# EasyEDA Pro project modern-cadet-v2.eprj, board PCB7
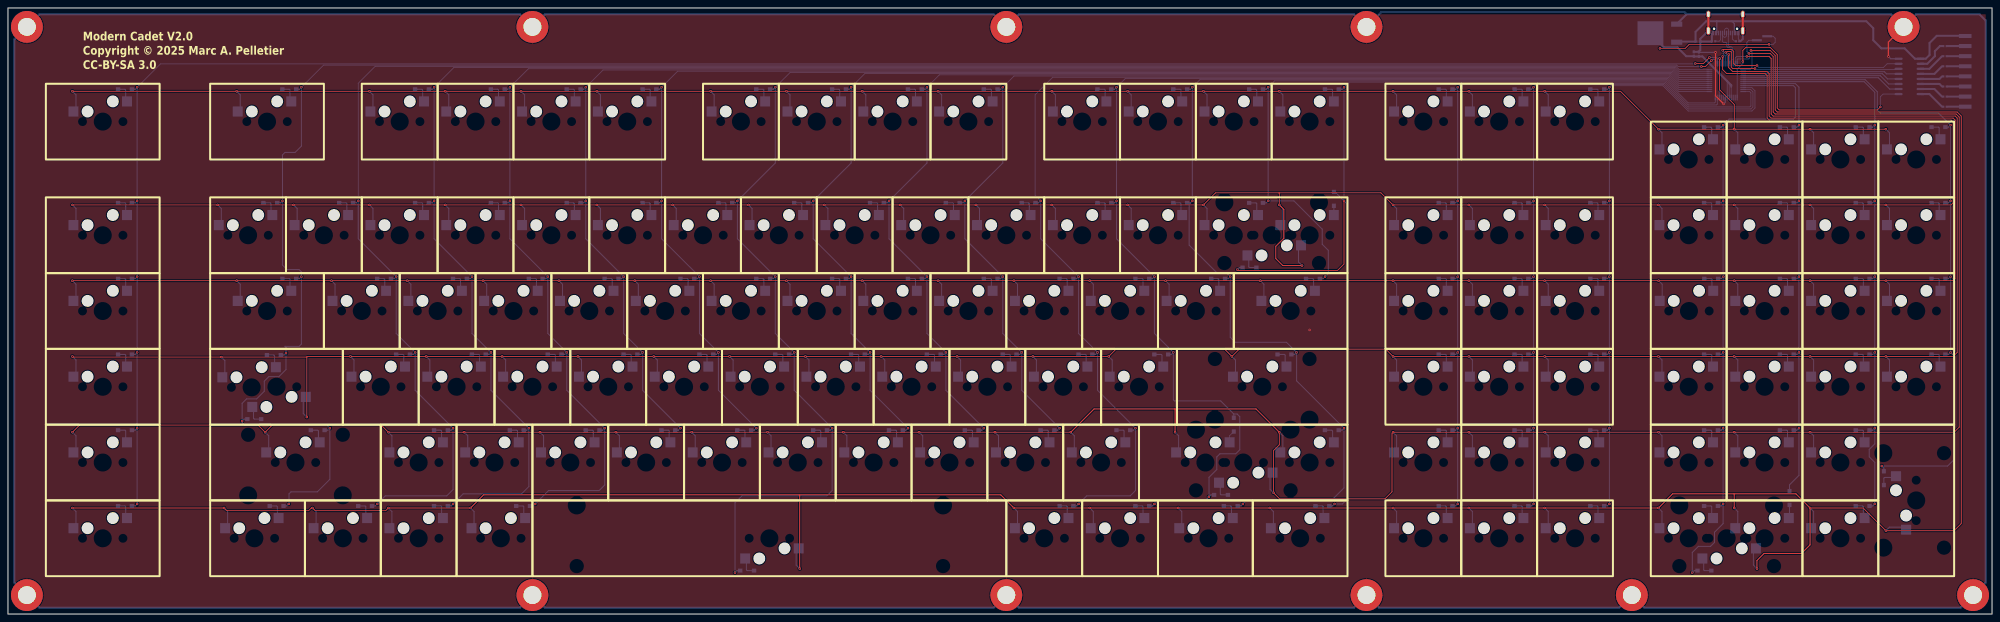
[diagram p6: board, top side]
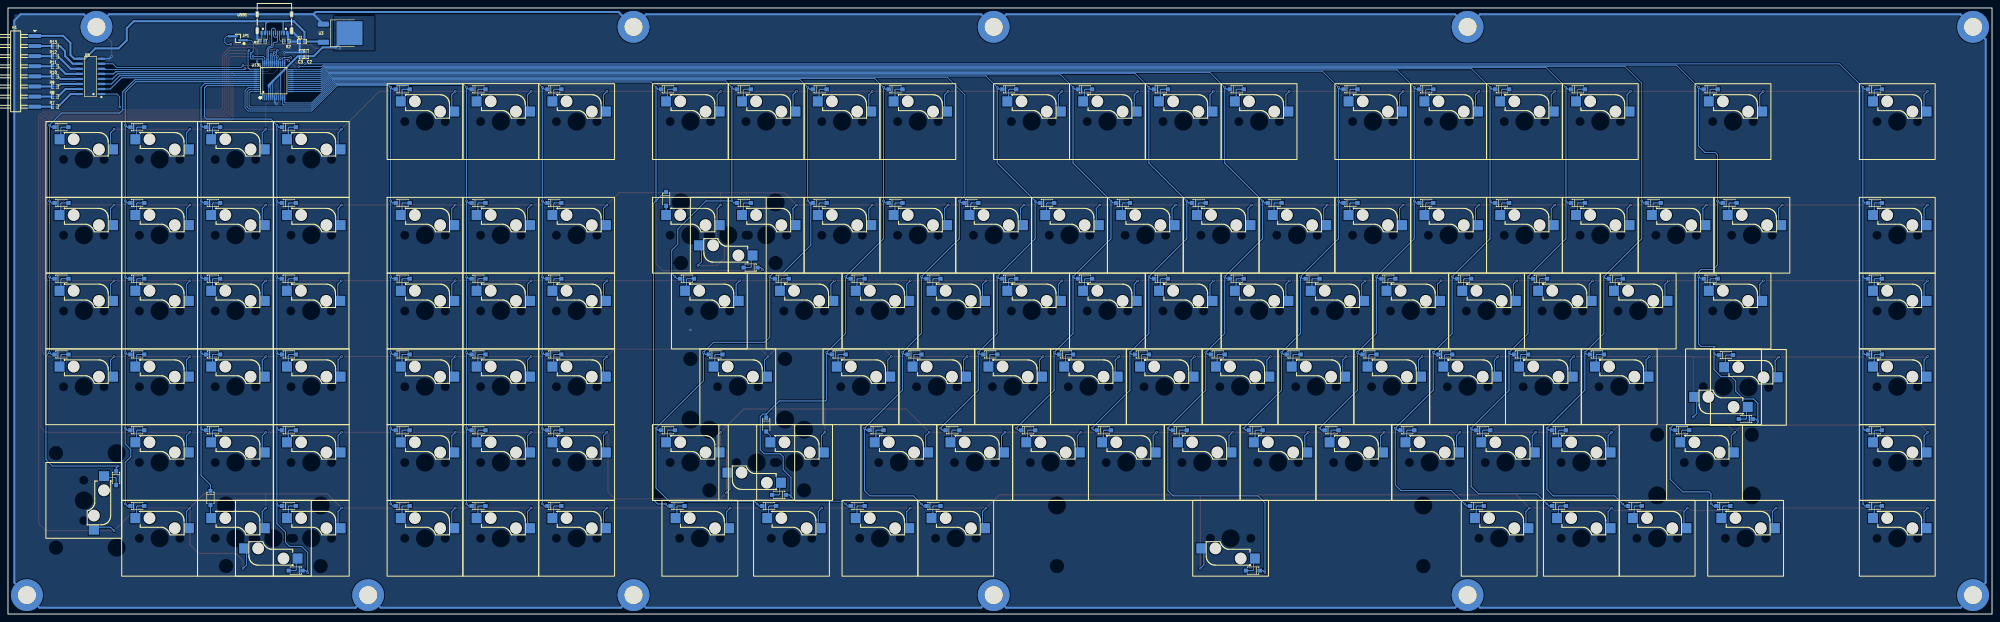
[diagram p7: board, bottom side, seen from below]

Outline 498.48 x 152.4 mm; copper layers: Top Layer, Bottom Layer. Coordinates in mm from the lower left corner of the outline.
Outline path: rectangle 0,152.4 498.48,0
Stack: Top Layer 0.035mm / Dielectric1 1.51mm FR4 er 4.5 / Bottom Layer 0.035mm

## Design rules (mm)
net D+: DP1
net D-: DP1
template: Custom Config
spacing copperThickness1oz (default): track to track 0.102, other pairs 0.152 to 0.3
spacing copperThickness2oz: track to track 0.203, other pairs 0.152 to 0.3
track width copperThickness1oz (default): min 0.127, default 0.254, max 2.54
track width copperThickness2oz: min 0.203, default 0.254, max 2.54
differential pair differentialPair (default): width min 0.127, default 0.254, max 2.54; gap min 0.152, default 0.152
via viaSize (default): diameter min 0.5, default 0.61, max 10; hole min 0.3, default 0.305, max 6.3
pour e5454 uses copperRegion

## Placement (name value [footprint] x y rotation side)
C1  10uF  [C0402]  424.62 143.95 180 bottom
C2  100nF  [C0402]  423.54 140.82 90 bottom
C3  10uF  [C0402]  424.81 140.76 90 bottom
D1  1N4148W  [SOD-123F_L2.7-W1.6-LS3.8-RD]  29.4 131.95 180 bottom
D2  1N4148W  [SOD-123F_L2.7-W1.6-LS3.8-RD]  70.68 131.95 180 bottom
D3  1N4148W  [SOD-123F_L2.7-W1.6-LS3.8-RD]  104.01 131.95 180 bottom
D4  1N4148W  [SOD-123F_L2.7-W1.6-LS3.8-RD]  123.06 131.95 180 bottom
D5  1N4148W  [SOD-123F_L2.7-W1.6-LS3.8-RD]  142.11 131.95 180 bottom
D6  1N4148W  [SOD-123F_L2.7-W1.6-LS3.8-RD]  161.16 131.95 180 bottom
D7  1N4148W  [SOD-123F_L2.7-W1.6-LS3.8-RD]  189.74 131.95 180 bottom
D8  1N4148W  [SOD-123F_L2.7-W1.6-LS3.8-RD]  208.79 131.95 180 bottom
D9  1N4148W  [SOD-123F_L2.7-W1.6-LS3.8-RD]  227.84 131.95 180 bottom
D10  1N4148W  [SOD-123F_L2.7-W1.6-LS3.8-RD]  246.89 131.95 180 bottom
D11  1N4148W  [SOD-123F_L2.7-W1.6-LS3.8-RD]  275.46 131.95 180 bottom
D12  1N4148W  [SOD-123F_L2.7-W1.6-LS3.8-RD]  294.51 131.95 180 bottom
D13  1N4148W  [SOD-123F_L2.7-W1.6-LS3.8-RD]  313.56 131.95 180 bottom
D14  1N4148W  [SOD-123F_L2.7-W1.6-LS3.8-RD]  332.61 131.95 180 bottom
D15  1N4148W  [SOD-123F_L2.7-W1.6-LS3.8-RD]  29.4 103.38 180 bottom
D16  1N4148W  [SOD-123F_L2.7-W1.6-LS3.8-RD]  65.91 103.38 180 bottom
D17  1N4148W  [SOD-123F_L2.7-W1.6-LS3.8-RD]  84.96 103.38 180 bottom
D18  1N4148W  [SOD-123F_L2.7-W1.6-LS3.8-RD]  104.01 103.38 180 bottom
D19  1N4148W  [SOD-123F_L2.7-W1.6-LS3.8-RD]  123.06 103.38 180 bottom
D20  1N4148W  [SOD-123F_L2.7-W1.6-LS3.8-RD]  142.11 103.38 180 bottom
D21  1N4148W  [SOD-123F_L2.7-W1.6-LS3.8-RD]  161.16 103.38 180 bottom
D22  1N4148W  [SOD-123F_L2.7-W1.6-LS3.8-RD]  180.21 103.38 180 bottom
D23  1N4148W  [SOD-123F_L2.7-W1.6-LS3.8-RD]  199.26 103.38 180 bottom
D24  1N4148W  [SOD-123F_L2.7-W1.6-LS3.8-RD]  218.31 103.38 180 bottom
D25  1N4148W  [SOD-123F_L2.7-W1.6-LS3.8-RD]  237.36 103.38 180 bottom
D26  1N4148W  [SOD-123F_L2.7-W1.6-LS3.8-RD]  256.41 103.38 180 bottom
D27  1N4148W  [SOD-123F_L2.7-W1.6-LS3.8-RD]  275.46 103.38 180 bottom
D28  1N4148W  [SOD-123F_L2.7-W1.6-LS3.8-RD]  294.51 103.38 180 bottom
D29  1N4148W  [SOD-123F_L2.7-W1.6-LS3.8-RD]  313.56 103.38 180 bottom
D30  1N4148W  [SOD-123F_L2.7-W1.6-LS3.8-RD]  333.12 104.39 270 bottom
D31  1N4148W  [SOD-123F_L2.7-W1.6-LS3.8-RD]  29.4 84.33 180 bottom
D32  1N4148W  [SOD-123F_L2.7-W1.6-LS3.8-RD]  70.68 84.33 180 bottom
D33  1N4148W  [SOD-123F_L2.7-W1.6-LS3.8-RD]  94.49 84.33 180 bottom
D34  1N4148W  [SOD-123F_L2.7-W1.6-LS3.8-RD]  113.54 84.33 180 bottom
D35  1N4148W  [SOD-123F_L2.7-W1.6-LS3.8-RD]  132.59 84.33 180 bottom
D36  1N4148W  [SOD-123F_L2.7-W1.6-LS3.8-RD]  151.64 84.33 180 bottom
D37  1N4148W  [SOD-123F_L2.7-W1.6-LS3.8-RD]  170.69 84.33 180 bottom
D38  1N4148W  [SOD-123F_L2.7-W1.6-LS3.8-RD]  189.74 84.33 180 bottom
D39  1N4148W  [SOD-123F_L2.7-W1.6-LS3.8-RD]  208.79 84.33 180 bottom
D40  1N4148W  [SOD-123F_L2.7-W1.6-LS3.8-RD]  227.84 84.33 180 bottom
D41  1N4148W  [SOD-123F_L2.7-W1.6-LS3.8-RD]  246.89 84.33 180 bottom
D42  1N4148W  [SOD-123F_L2.7-W1.6-LS3.8-RD]  265.94 84.33 180 bottom
D43  1N4148W  [SOD-123F_L2.7-W1.6-LS3.8-RD]  284.99 84.33 180 bottom
D44  1N4148W  [SOD-123F_L2.7-W1.6-LS3.8-RD]  304.04 84.33 180 bottom
D45  1N4148W  [SOD-123F_L2.7-W1.6-LS3.8-RD]  327.85 84.33 180 bottom
D46  1N4148W  [SOD-123F_L2.7-W1.6-LS3.8-RD]  29.4 65.28 180 bottom
D47  1N4148W  [SOD-123F_L2.7-W1.6-LS3.8-RD]  66.8 65.13 180 bottom
D48  1N4148W  [SOD-123F_L2.7-W1.6-LS3.8-RD]  99.25 65.28 180 bottom
D49  1N4148W  [SOD-123F_L2.7-W1.6-LS3.8-RD]  118.3 65.28 180 bottom
D50  1N4148W  [SOD-123F_L2.7-W1.6-LS3.8-RD]  137.35 65.28 180 bottom
D51  1N4148W  [SOD-123F_L2.7-W1.6-LS3.8-RD]  156.4 65.28 180 bottom
D52  1N4148W  [SOD-123F_L2.7-W1.6-LS3.8-RD]  175.45 65.28 180 bottom
D53  1N4148W  [SOD-123F_L2.7-W1.6-LS3.8-RD]  194.5 65.28 180 bottom
D54  1N4148W  [SOD-123F_L2.7-W1.6-LS3.8-RD]  213.55 65.28 180 bottom
D55  1N4148W  [SOD-123F_L2.7-W1.6-LS3.8-RD]  232.6 65.28 180 bottom
D56  1N4148W  [SOD-123F_L2.7-W1.6-LS3.8-RD]  251.65 65.28 180 bottom
D57  1N4148W  [SOD-123F_L2.7-W1.6-LS3.8-RD]  270.7 65.28 180 bottom
D58  1N4148W  [SOD-123F_L2.7-W1.6-LS3.8-RD]  289.75 65.28 180 bottom
D59  1N4148W  [SOD-123F_L2.7-W1.6-LS3.8-RD]  29.4 46.23 180 bottom
D60  1N4148W  [SOD-123F_L2.7-W1.6-LS3.8-RD]  77.82 46.23 180 bottom
D61  1N4148W  [SOD-123F_L2.7-W1.6-LS3.8-RD]  108.78 46.23 180 bottom
D62  1N4148W  [SOD-123F_L2.7-W1.6-LS3.8-RD]  127.83 46.23 180 bottom
D63  1N4148W  [SOD-123F_L2.7-W1.6-LS3.8-RD]  146.88 46.23 180 bottom
D64  1N4148W  [SOD-123F_L2.7-W1.6-LS3.8-RD]  165.93 46.23 180 bottom
D65  1N4148W  [SOD-123F_L2.7-W1.6-LS3.8-RD]  184.98 46.23 180 bottom
D66  1N4148W  [SOD-123F_L2.7-W1.6-LS3.8-RD]  204.03 46.23 180 bottom
D67  1N4148W  [SOD-123F_L2.7-W1.6-LS3.8-RD]  223.08 46.23 180 bottom
D68  1N4148W  [SOD-123F_L2.7-W1.6-LS3.8-RD]  242.13 46.23 180 bottom
D69  1N4148W  [SOD-123F_L2.7-W1.6-LS3.8-RD]  261.18 46.23 180 bottom
D70  1N4148W  [SOD-123F_L2.7-W1.6-LS3.8-RD]  280.23 46.23 180 bottom
D71  1N4148W  [SOD-123F_L2.7-W1.6-LS3.8-RD]  304.77 29.97 0 bottom
D72  1N4148W  [SOD-123F_L2.7-W1.6-LS3.8-RD]  332.61 46.23 180 bottom
D73  1N4148W  [SOD-123F_L2.7-W1.6-LS3.8-RD]  320.71 65.28 180 bottom
D74  1N4148W  [SOD-123F_L2.7-W1.6-LS3.8-RD]  29.4 27.18 180 bottom
D75  1N4148W  [SOD-123F_L2.7-W1.6-LS3.8-RD]  67.5 27.18 180 bottom
D76  1N4148W  [SOD-123F_L2.7-W1.6-LS3.8-RD]  89.73 27.18 180 bottom
D77  1N4148W  [SOD-123F_L2.7-W1.6-LS3.8-RD]  265.94 27.18 180 bottom
D78  1N4148W  [SOD-123F_L2.7-W1.6-LS3.8-RD]  284.99 27.18 180 bottom
D79  1N4148W  [SOD-123F_L2.7-W1.6-LS3.8-RD]  307.21 27.18 180 bottom
D80  1N4148W  [SOD-123F_L2.7-W1.6-LS3.8-RD]  330.23 27.18 180 bottom
D81  1N4148W  [SOD-123F_L2.7-W1.6-LS3.8-RD]  185.71 10.92 0 bottom
D82  1N4148W  [SOD-123F_L2.7-W1.6-LS3.8-RD]  61.88 49.02 0 bottom
D83  1N4148W  [SOD-123F_L2.7-W1.6-LS3.8-RD]  108.78 27.18 180 bottom
D84  1N4148W  [SOD-123F_L2.7-W1.6-LS3.8-RD]  129.41 27.18 180 bottom
D85  1N4148W  [SOD-123F_L2.7-W1.6-LS3.8-RD]  311.91 87.12 0 bottom
D86  1N4148W  [SOD-123F_L2.7-W1.6-LS3.8-RD]  361.19 131.95 180 bottom
D87  1N4148W  [SOD-123F_L2.7-W1.6-LS3.8-RD]  380.24 131.95 180 bottom
D88  1N4148W  [SOD-123F_L2.7-W1.6-LS3.8-RD]  399.29 131.95 180 bottom
D89  1N4148W  [SOD-123F_L2.7-W1.6-LS3.8-RD]  361.19 103.38 180 bottom
D90  1N4148W  [SOD-123F_L2.7-W1.6-LS3.8-RD]  380.24 103.38 180 bottom
D91  1N4148W  [SOD-123F_L2.7-W1.6-LS3.8-RD]  399.29 103.38 180 bottom
D92  1N4148W  [SOD-123F_L2.7-W1.6-LS3.8-RD]  361.19 84.33 180 bottom
D93  1N4148W  [SOD-123F_L2.7-W1.6-LS3.8-RD]  380.24 84.33 180 bottom
D94  1N4148W  [SOD-123F_L2.7-W1.6-LS3.8-RD]  399.29 84.33 180 bottom
D95  1N4148W  [SOD-123F_L2.7-W1.6-LS3.8-RD]  361.19 65.28 180 bottom
D96  1N4148W  [SOD-123F_L2.7-W1.6-LS3.8-RD]  380.24 65.28 180 bottom
D97  1N4148W  [SOD-123F_L2.7-W1.6-LS3.8-RD]  399.29 65.28 180 bottom
D98  1N4148W  [SOD-123F_L2.7-W1.6-LS3.8-RD]  361.19 46.23 180 bottom
D99  1N4148W  [SOD-123F_L2.7-W1.6-LS3.8-RD]  380.24 46.23 180 bottom
D100  1N4148W  [SOD-123F_L2.7-W1.6-LS3.8-RD]  399.29 46.23 180 bottom
D101  1N4148W  [SOD-123F_L2.7-W1.6-LS3.8-RD]  361.19 27.18 180 bottom
D102  1N4148W  [SOD-123F_L2.7-W1.6-LS3.8-RD]  380.24 27.18 180 bottom
D103  1N4148W  [SOD-123F_L2.7-W1.6-LS3.8-RD]  399.29 27.18 180 bottom
D104  1N4148W  [SOD-123F_L2.7-W1.6-LS3.8-RD]  427.86 122.43 180 bottom
D105  1N4148W  [SOD-123F_L2.7-W1.6-LS3.8-RD]  446.91 122.43 180 bottom
D106  1N4148W  [SOD-123F_L2.7-W1.6-LS3.8-RD]  465.96 122.43 180 bottom
D107  1N4148W  [SOD-123F_L2.7-W1.6-LS3.8-RD]  485.01 122.43 180 bottom
D108  1N4148W  [SOD-123F_L2.7-W1.6-LS3.8-RD]  427.86 103.38 180 bottom
D109  1N4148W  [SOD-123F_L2.7-W1.6-LS3.8-RD]  446.91 103.38 180 bottom
D110  1N4148W  [SOD-123F_L2.7-W1.6-LS3.8-RD]  465.96 103.38 180 bottom
D111  1N4148W  [SOD-123F_L2.7-W1.6-LS3.8-RD]  485.01 103.38 180 bottom
D112  1N4148W  [SOD-123F_L2.7-W1.6-LS3.8-RD]  427.92 84.33 180 bottom
D113  1N4148W  [SOD-123F_L2.7-W1.6-LS3.8-RD]  446.91 84.33 180 bottom
D114  1N4148W  [SOD-123F_L2.7-W1.6-LS3.8-RD]  465.96 84.33 180 bottom
D115  1N4148W  [SOD-123F_L2.7-W1.6-LS3.8-RD]  485.01 84.33 180 bottom
D116  1N4148W  [SOD-123F_L2.7-W1.6-LS3.8-RD]  427.86 65.28 180 bottom
D117  1N4148W  [SOD-123F_L2.7-W1.6-LS3.8-RD]  446.91 65.28 180 bottom
D118  1N4148W  [SOD-123F_L2.7-W1.6-LS3.8-RD]  465.96 65.28 180 bottom
D119  1N4148W  [SOD-123F_L2.7-W1.6-LS3.8-RD]  485.01 65.28 180 bottom
D120  1N4148W  [SOD-123F_L2.7-W1.6-LS3.8-RD]  427.86 46.23 180 bottom
D121  1N4148W  [SOD-123F_L2.7-W1.6-LS3.8-RD]  446.91 46.23 180 bottom
D122  1N4148W  [SOD-123F_L2.7-W1.6-LS3.8-RD]  465.96 46.23 180 bottom
D123  1N4148W  [SOD-123F_L2.7-W1.6-LS3.8-RD]  427.86 27.18 180 bottom
D124  1N4148W  [SOD-123F_L2.7-W1.6-LS3.8-RD]  447.6 29.17 270 bottom
D125  1N4148W  [SOD-123F_L2.7-W1.6-LS3.8-RD]  465.96 27.18 180 bottom
D126  1N4148W  [SOD-123F_L2.7-W1.6-LS3.8-RD]  471.3 34.16 270 bottom
D127  1N4148W  [SOD-123F_L2.7-W1.6-LS3.8-RD]  426.21 10.92 0 bottom
D128  1N4148W  [SOD-123F_L2.7-W1.6-LS3.8-RD]  307.98 47.62 270 bottom
H1  X6511WRS-08H-C60D48  [HDR-SMD_8P-P2.54-H-M-W13.3-N]  491.74 136.46 270 bottom
JP1  ZX-PZ1.0-1-2PWZ  [HDR-SMD_2P-P1.00-V-M-LS4.0]  440.69 144.78 90 bottom
R1  5.1kΩ  [R0402]  434.54 144.04 180 bottom
R2  5.1kΩ  [R0402]  428.52 144.04 0 bottom
R7  220Ω  [R0402]  486.66 127.57 180 bottom
R8  220Ω  [R0402]  486.66 130.11 180 bottom
R9  220Ω  [R0402]  486.66 132.65 180 bottom
R10  220Ω  [R0402]  486.66 135.19 180 bottom
R11  220Ω  [R0402]  486.66 137.73 180 bottom
R12  220Ω  [R0402]  486.66 140.27 180 bottom
R13  220Ω  [R0402]  486.66 142.81 180 bottom
SCREW1  -  [M4 screw]  4.76 147.64 0 top
SCREW2  -  [M4 screw]  476.25 147.64 180 bottom
SCREW3  -  [M4 screw]  4.76 4.76 0 top
SCREW4  -  [M4 screw]  493.71 4.76 0 top
SCREW5  -  [M4 screw]  250.82 147.64 0 top
SCREW8  -  [M4 screw]  407.99 4.76 0 top
SCREW9  -  [M4 screw]  341.31 147.64 0 top
SCREW10  -  [M4 screw]  250.82 4.76 0 top
SCREW11  -  [M4 screw]  341.31 4.76 0 top
SCREW12  -  [M4 screw]  131.76 4.76 0 top
SCREW13  -  [M4 screw]  131.76 147.64 0 top
U1  CPG151101S11-16  [SMD_KEYBOARD-SW]  23.18 127.64 0 bottom
U3  NCP1117DT33RKG  [TO-252-2_L6.6-W6.1-P4.57-LS9.9-TL-CW]  415.95 146.06 180 bottom
U4  CPG151101S11-16  [SMD_KEYBOARD-SW]  64.45 127.64 0 bottom
U5  ULN2003ALDTR(XBLW)  [SOP-16_L9.9-W3.9-P1.27-LS6.0-BL]  477.77 135.19 90 bottom
U6  CPG151101S11-16  [SMD_KEYBOARD-SW]  97.79 127.64 0 bottom
U7  CPG151101S11-16  [SMD_KEYBOARD-SW]  116.84 127.64 0 bottom
U8  CPG151101S11-16  [SMD_KEYBOARD-SW]  135.89 127.64 0 bottom
U9  CPG151101S11-16  [SMD_KEYBOARD-SW]  154.94 127.64 0 bottom
U10  CPG151101S11-16  [SMD_KEYBOARD-SW]  183.51 127.64 0 bottom
U11  CPG151101S11-16  [SMD_KEYBOARD-SW]  202.56 127.64 0 bottom
U12  CPG151101S11-16  [SMD_KEYBOARD-SW]  221.62 127.64 0 bottom
U13  CPG151101S11-16  [SMD_KEYBOARD-SW]  240.66 127.64 0 bottom
U14  CPG151101S11-16  [SMD_KEYBOARD-SW]  269.24 127.64 0 bottom
U15  CPG151101S11-16  [SMD_KEYBOARD-SW]  288.29 127.64 0 bottom
U16  CPG151101S11-16  [SMD_KEYBOARD-SW]  307.34 127.64 0 bottom
U17  CPG151101S11-16  [SMD_KEYBOARD-SW]  326.39 127.64 0 bottom
U18  CPG151101S11-16  [SMD_KEYBOARD-SW]  23.18 99.06 0 bottom
U19  CPG151101S11-16  [SMD_KEYBOARD-SW]  59.69 99.06 0 bottom
U20  CPG151101S11-16  [SMD_KEYBOARD-SW]  78.74 99.06 0 bottom
U21  CPG151101S11-16  [SMD_KEYBOARD-SW]  97.79 99.06 0 bottom
U22  CPG151101S11-16  [SMD_KEYBOARD-SW]  116.84 99.06 0 bottom
U23  CPG151101S11-16  [SMD_KEYBOARD-SW]  135.89 99.06 0 bottom
U24  CPG151101S11-16  [SMD_KEYBOARD-SW]  154.94 99.06 0 bottom
U25  CPG151101S11-16  [SMD_KEYBOARD-SW]  173.99 99.06 0 bottom
U26  CPG151101S11-16  [SMD_KEYBOARD-SW]  193.04 99.06 0 bottom
U27  CPG151101S11-16  [SMD_KEYBOARD-SW]  212.09 99.06 0 bottom
U28  CPG151101S11-16  [SMD_KEYBOARD-SW]  231.14 99.06 0 bottom
U29  CPG151101S11-16  [SMD_KEYBOARD-SW]  250.19 99.06 0 bottom
U30  CPG151101S11-16  [SMD_KEYBOARD-SW]  269.24 99.06 0 bottom
U31  CPG151101S11-16  [SMD_KEYBOARD-SW]  288.29 99.06 0 bottom
U32  CPG151101S11-16  [SMD_KEYBOARD-SW]  307.34 99.06 0 bottom
U33  CPG151101S11-16  [SMD_KEYBOARD-SW]  326.39 99.06 0 bottom
U34  CPG151101S11-16  [SMD_KEYBOARD-SW]  23.18 80.01 0 bottom
U35  CPG151101S11-16  [SMD_KEYBOARD-SW]  64.45 80.01 0 bottom
U36  CPG151101S11-16  [SMD_KEYBOARD-SW]  88.27 80.01 0 bottom
U37  CPG151101S11-16  [SMD_KEYBOARD-SW]  107.31 80.01 0 bottom
U38  CPG151101S11-16  [SMD_KEYBOARD-SW]  126.36 80.01 0 bottom
U39  CPG151101S11-16  [SMD_KEYBOARD-SW]  145.41 80.01 0 bottom
U40  CPG151101S11-16  [SMD_KEYBOARD-SW]  164.47 80.01 0 bottom
U41  CPG151101S11-16  [SMD_KEYBOARD-SW]  183.51 80.01 0 bottom
U42  CPG151101S11-16  [SMD_KEYBOARD-SW]  202.56 80.01 0 bottom
U43  CPG151101S11-16  [SMD_KEYBOARD-SW]  221.62 80.01 0 bottom
U44  CPG151101S11-16  [SMD_KEYBOARD-SW]  240.66 80.01 0 bottom
U45  CPG151101S11-16  [SMD_KEYBOARD-SW]  259.72 80.01 0 bottom
U46  CPG151101S11-16  [SMD_KEYBOARD-SW]  278.76 80.01 0 bottom
U47  CPG151101S11-16  [SMD_KEYBOARD-SW]  297.81 80.01 0 bottom
U48  CPG151101S11-16  [SMD_KEYBOARD-SW]  321.63 80.01 0 bottom
U49  CPG151101S11-16  [SMD_KEYBOARD-SW]  23.18 60.96 0 bottom
U50  CPG151101S11-16  [SMD_KEYBOARD-SW]  60.58 60.81 0 bottom
U51  CPG151101S11-16  [SMD_KEYBOARD-SW]  93.03 60.96 0 bottom
U52  CPG151101S11-16  [SMD_KEYBOARD-SW]  112.08 60.96 0 bottom
U53  CPG151101S11-16  [SMD_KEYBOARD-SW]  131.13 60.96 0 bottom
U54  CPG151101S11-16  [SMD_KEYBOARD-SW]  150.18 60.96 0 bottom
U55  CPG151101S11-16  [SMD_KEYBOARD-SW]  169.23 60.96 0 bottom
U56  CPG151101S11-16  [SMD_KEYBOARD-SW]  188.28 60.96 0 bottom
U57  CPG151101S11-16  [SMD_KEYBOARD-SW]  207.33 60.96 0 bottom
U58  CPG151101S11-16  [SMD_KEYBOARD-SW]  226.38 60.96 0 bottom
U59  CPG151101S11-16  [SMD_KEYBOARD-SW]  245.43 60.96 0 bottom
U60  CPG151101S11-16  [SMD_KEYBOARD-SW]  264.48 60.96 0 bottom
U61  CPG151101S11-16  [SMD_KEYBOARD-SW]  283.53 60.96 0 bottom
U62  CPG151101S11-16  [SMD_KEYBOARD-SW]  23.18 41.91 0 bottom
U63  CPG151101S11-16  [SMD_KEYBOARD-SW]  71.6 41.91 0 bottom
U64  CPG151101S11-16  [SMD_KEYBOARD-SW]  102.55 41.91 0 bottom
U65  CPG151101S11-16  [SMD_KEYBOARD-SW]  121.6 41.91 0 bottom
U66  CPG151101S11-16  [SMD_KEYBOARD-SW]  140.65 41.91 0 bottom
U67  CPG151101S11-16  [SMD_KEYBOARD-SW]  159.7 41.91 0 bottom
U68  CPG151101S11-16  [SMD_KEYBOARD-SW]  178.75 41.91 0 bottom
U69  CPG151101S11-16  [SMD_KEYBOARD-SW]  197.8 41.91 0 bottom
U70  CPG151101S11-16  [SMD_KEYBOARD-SW]  216.85 41.91 0 bottom
U71  CPG151101S11-16  [SMD_KEYBOARD-SW]  235.9 41.91 0 bottom
U72  CPG151101S11-16  [SMD_KEYBOARD-SW]  254.95 41.91 0 bottom
U73  CPG151101S11-16  [SMD_KEYBOARD-SW]  274 41.91 0 bottom
U74  CPG151101S11-16  [SMD_KEYBOARD-SW]  310.99 34.29 180 bottom
U75  CPG151101S11-16  [SMD_KEYBOARD-SW]  326.39 41.91 0 bottom
U76  CPG151101S11-16  [SMD_KEYBOARD-SW]  314.48 60.96 0 bottom
U77  CPG151101S11-16  [SMD_KEYBOARD-SW]  23.18 22.86 0 bottom
U78  CPG151101S11-16  [SMD_KEYBOARD-SW]  61.28 22.86 0 bottom
U79  CPG151101S11-16  [SMD_KEYBOARD-SW]  83.5 22.86 0 bottom
U80  CPG151101S11-16  [SMD_KEYBOARD-SW]  259.72 22.86 0 bottom
U81  CPG151101S11-16  [SMD_KEYBOARD-SW]  278.76 22.86 0 bottom
U82  CPG151101S11-16  [SMD_KEYBOARD-SW]  300.99 22.86 0 bottom
U83  CPG151101S11-16  [SMD_KEYBOARD-SW]  324.01 22.86 0 bottom
U84  CPG151101S11-16  [SMD_KEYBOARD-SW]  191.93 15.24 180 bottom
U85  CPG151101S11-16  [SMD_KEYBOARD-SW]  68.1 53.34 180 bottom
U86  CPG151101S11-16  [SMD_KEYBOARD-SW]  102.55 22.86 0 bottom
U87  CPG151101S11-16  [SMD_KEYBOARD-SW]  123.19 22.86 0 bottom
U88  CPG151101S11-16  [SMD_KEYBOARD-SW]  318.13 91.44 180 bottom
U89  CPG151101S11-16  [SMD_KEYBOARD-SW]  354.97 127.64 0 bottom
U90  CPG151101S11-16  [SMD_KEYBOARD-SW]  374.01 127.64 0 bottom
U91  CPG151101S11-16  [SMD_KEYBOARD-SW]  393.06 127.64 0 bottom
U92  CPG151101S11-16  [SMD_KEYBOARD-SW]  354.97 99.06 0 bottom
U93  CPG151101S11-16  [SMD_KEYBOARD-SW]  374.01 99.06 0 bottom
U94  CPG151101S11-16  [SMD_KEYBOARD-SW]  393.06 99.06 0 bottom
U95  CPG151101S11-16  [SMD_KEYBOARD-SW]  354.97 80.01 0 bottom
U96  CPG151101S11-16  [SMD_KEYBOARD-SW]  374.01 80.01 0 bottom
U97  CPG151101S11-16  [SMD_KEYBOARD-SW]  393.06 80.01 0 bottom
U98  CPG151101S11-16  [SMD_KEYBOARD-SW]  354.97 60.96 0 bottom
U99  CPG151101S11-16  [SMD_KEYBOARD-SW]  374.01 60.96 0 bottom
U100  CPG151101S11-16  [SMD_KEYBOARD-SW]  393.06 60.96 0 bottom
U101  CPG151101S11-16  [SMD_KEYBOARD-SW]  354.97 41.91 0 bottom
U102  CPG151101S11-16  [SMD_KEYBOARD-SW]  374.01 41.91 0 bottom
U103  CPG151101S11-16  [SMD_KEYBOARD-SW]  393.06 41.91 0 bottom
U104  CPG151101S11-16  [SMD_KEYBOARD-SW]  354.97 22.86 0 bottom
U105  CPG151101S11-16  [SMD_KEYBOARD-SW]  374.01 22.86 0 bottom
U106  CPG151101S11-16  [SMD_KEYBOARD-SW]  393.06 22.86 0 bottom
U107  CPG151101S11-16  [SMD_KEYBOARD-SW]  421.64 118.11 0 bottom
U108  CPG151101S11-16  [SMD_KEYBOARD-SW]  440.69 118.11 0 bottom
U109  CPG151101S11-16  [SMD_KEYBOARD-SW]  459.74 118.11 0 bottom
U110  CPG151101S11-16  [SMD_KEYBOARD-SW]  478.79 118.11 0 bottom
U111  CPG151101S11-16  [SMD_KEYBOARD-SW]  421.64 99.06 0 bottom
U112  CPG151101S11-16  [SMD_KEYBOARD-SW]  440.69 99.06 0 bottom
U113  CPG151101S11-16  [SMD_KEYBOARD-SW]  459.74 99.06 0 bottom
U114  CPG151101S11-16  [SMD_KEYBOARD-SW]  478.79 99.06 0 bottom
U115  CPG151101S11-16  [SMD_KEYBOARD-SW]  421.7 80.01 0 bottom
U116  CPG151101S11-16  [SMD_KEYBOARD-SW]  440.69 80.01 0 bottom
U117  CPG151101S11-16  [SMD_KEYBOARD-SW]  459.74 80.01 0 bottom
U118  CPG151101S11-16  [SMD_KEYBOARD-SW]  478.79 80.01 0 bottom
U119  CPG151101S11-16  [SMD_KEYBOARD-SW]  421.64 60.96 0 bottom
U120  CPG151101S11-16  [SMD_KEYBOARD-SW]  440.69 60.96 0 bottom
U121  CPG151101S11-16  [SMD_KEYBOARD-SW]  459.74 60.96 0 bottom
U122  CPG151101S11-16  [SMD_KEYBOARD-SW]  478.79 60.96 0 bottom
U123  CPG151101S11-16  [SMD_KEYBOARD-SW]  421.64 41.91 0 bottom
U124  CPG151101S11-16  [SMD_KEYBOARD-SW]  440.69 41.91 0 bottom
U125  CPG151101S11-16  [SMD_KEYBOARD-SW]  459.74 41.91 0 bottom
U126  CPG151101S11-16  [SMD_KEYBOARD-SW]  421.64 22.86 0 bottom
U127  CPG151101S11-16  [SMD_KEYBOARD-SW]  440.69 22.86 0 bottom
U128  CPG151101S11-16  [SMD_KEYBOARD-SW]  459.74 22.86 0 bottom
U129  CPG151101S11-16  [SMD_KEYBOARD-SW]  475.62 27.94 90 bottom
U130  CPG151101S11-16  [SMD_KEYBOARD-SW]  432.44 15.24 180 bottom
U131  STM32G0B1CBT6  [LQFP-48_L7.0-W7.0-P0.50-LS9.0-BL]  431.7 134.11 180 bottom
U132  CPG151101S11-16  [SMD_KEYBOARD-SW]  300.21 41.91 0 bottom
USB1  TYPE-C 16P(073)  [USB-C-SMD_TYPE-C16PIN_C668624]  431.53 148.46 0 bottom

## Footprints (pads in the part's own frame, mm; a bottom-side part is the same pattern mirrored in y, then rotated)
C0402
  rect 0.79x0.54 smd: 1(-0.545,0) 2(0.545,0)
HDR-SMD_2P-P1.00-V-M-LS4.0
  rect 0.56x2.5 smd: 1(-0.5,-1.3) 2(0.5,1.3)
HDR-SMD_8P-P2.54-H-M-W13.3-N
  rect 1.02x3.16 smd: 1(-8.89,0) 2(-6.35,0) 3(-3.81,0) 4(-1.27,0) 5(1.27,0) 6(3.81,0) 7(6.35,0) 8(8.89,0)
LQFP-48_L7.0-W7.0-P0.50-LS9.0-BL
  oval 0.27x1.5 smd: 1(-2.75,-4.25) 2(-2.25,-4.25) 3(-1.75,-4.25) 4(-1.25,-4.25) 5(-0.75,-4.25) 6(-0.25,-4.25) 7(0.25,-4.25) 8(0.75,-4.25) 9(1.25,-4.25) 10(1.75,-4.25) 11(2.25,-4.25) 12(2.75,-4.25) 25(2.75,4.25) 26(2.25,4.25) 27(1.75,4.25) 28(1.25,4.25) 29(0.75,4.25) 30(0.25,4.25) 31(-0.25,4.25) 32(-0.75,4.25) 33(-1.25,4.25) 34(-1.75,4.25) 35(-2.25,4.25) 36(-2.75,4.25)
  oval 1.5x0.27 smd: 13(4.25,-2.75) 14(4.25,-2.25) 15(4.25,-1.75) 16(4.25,-1.25) 17(4.25,-0.75) 18(4.25,-0.25) 19(4.25,0.25) 20(4.25,0.75) 21(4.25,1.25) 22(4.25,1.75) 23(4.25,2.25) 24(4.25,2.75) 37(-4.25,2.75) 38(-4.25,2.25) 39(-4.25,1.75) 40(-4.25,1.25) 41(-4.25,0.75) 42(-4.25,0.25) 43(-4.25,-0.25) 44(-4.25,-0.75) 45(-4.25,-1.25) 46(-4.25,-1.75) 47(-4.25,-2.25) 48(-4.25,-2.75)
M4 screw
  round 8 hole 4.5: 1(0,0)
R0402
  rect 0.566x0.54 smd: 1(-0.433,0) 2(0.433,0)
SMD_KEYBOARD-SW
  rect 2.5x2.55 smd: 1(-6.725,1.27) 2(6.725,-1.27)
SOD-123F_L2.7-W1.6-LS3.8-RD
  rect 1.1x1 smd: 1(-1.735,0) 2(1.735,0)
SOP-16_L9.9-W3.9-P1.27-LS6.0-BL
  oval 0.574x2.038 smd: 1(-4.445,-2.769) 2(-3.175,-2.769) 3(-1.905,-2.769) 4(-0.635,-2.769) 5(0.635,-2.769) 6(1.905,-2.769) 7(3.175,-2.769) 8(4.445,-2.769) 9(4.445,2.769) 10(3.175,2.769) 11(1.905,2.769) 12(0.635,2.769) 13(-0.635,2.769) 14(-1.905,2.769) 15(-3.175,2.769) 16(-4.445,2.769)
TO-252-2_L6.6-W6.1-P4.57-LS9.9-TL-CW
  rect 2.8x1.3 smd: 1(-3.292,2.273) 3(-3.292,-2.273)
  rect 6.5x6 smd: 2(3.292,0)
USB-C-SMD_TYPE-C16PIN_C668624
  oval 1x2.1 hole 0.6x1.7: 1(-4.32,1.788) 2(4.32,1.788)
  oval 1x1.8 hole 0.6x1.4: 3(-4.32,-2.362) 4(4.32,-2.362)
  rect 0.6x1.15 smd: A1B12(-3.2,2.362) A4B9(-2.4,2.362) B1A12(3.2,2.362) B4A9(2.4,2.362)
  rect 0.3x1.15 smd: A5(-1.25,2.362) A6(-0.25,2.362) A7(0.25,2.362) A8(1.25,2.362) B5(1.75,2.362) B6(0.75,2.362) B7(-0.75,2.362) B8(-1.75,2.362)

## Nets
+5V: C1.2 H1.1 U3.3 U5.9 USB1.A4B9 USB1.B4A9
GND: C1.1 C2.2 C3.2 R1.1 R2.1 SCREW1.1 SCREW2.1 SCREW3.1 SCREW4.1 SCREW5.1 SCREW8.1 SCREW9.1 SCREW10.1 SCREW11.1 SCREW12.1 SCREW13.1 U3.1 U5.8 U131.7 USB1.1 USB1.2 USB1.3 USB1.4 USB1.A1B12 USB1.B1A12
VCC: C2.1 C3.1 JP1.2 U3.2 U131.4 U131.5 U131.6 U131.10
$1I32594\$1N478: D1.2 U1.2
$1I32622\$1N478: D2.2 U4.2
$1I32637\$1N478: D3.2 U6.2
$1I32652\$1N478: D4.2 U7.2
$1I32667\$1N478: D5.2 U8.2
$1I32682\$1N478: D6.2 U9.2
$1I32697\$1N478: D7.2 U10.2
$1I32712\$1N478: D8.2 U11.2
$1I32727\$1N478: D9.2 U12.2
$1I32742\$1N478: D10.2 U13.2
$1I32757\$1N478: D11.2 U14.2
$1I32772\$1N478: D12.2 U15.2
$1I32787\$1N478: D13.2 U16.2
$1I32802\$1N478: D14.2 U17.2
$1I32817\$1N478: D15.2 U18.2
$1I32832\$1N478: D16.2 U19.2
$1I32848\$1N478: D17.2 U20.2
$1I32863\$1N478: D18.2 U21.2
$1I32879\$1N478: D19.2 U22.2
$1I32895\$1N478: D20.2 U23.2
$1I32911\$1N478: D21.2 U24.2
$1I32927\$1N478: D22.2 U25.2
$1I32943\$1N478: D23.2 U26.2
$1I32959\$1N478: D24.2 U27.2
$1I32975\$1N478: D25.2 U28.2
$1I32991\$1N478: D26.2 U29.2
$1I33006\$1N478: D27.2 U30.2
$1I33022\$1N478: D28.2 U31.2
$1I33038\$1N478: D29.2 U32.2
$1I33054\$1N478: D30.2 U33.2
$1I33070\$1N478: D31.2 U34.2
$1I33085\$1N478: D32.2 U35.2
$1I33101\$1N478: D33.2 U36.2
$1I33117\$1N478: D34.2 U37.2
$1I33133\$1N478: D35.2 U38.2
$1I33149\$1N478: D36.2 U39.2
$1I33165\$1N478: D37.2 U40.2
$1I33181\$1N478: D38.2 U41.2
$1I33197\$1N478: D39.2 U42.2
$1I33213\$1N478: D40.2 U43.2
$1I33229\$1N478: D41.2 U44.2
$1I33245\$1N478: D42.2 U45.2
$1I33261\$1N478: D43.2 U46.2
$1I33277\$1N478: D44.2 U47.2
$1I33293\$1N478: D45.2 U48.2
$1I33325\$1N478: D46.2 U49.2
$1I33340\$1N478: D47.2 U50.2
$1I33356\$1N478: D48.2 U51.2
$1I33372\$1N478: D49.2 U52.2
$1I33388\$1N478: D50.2 U53.2
$1I33404\$1N478: D51.2 U54.2
$1I33420\$1N478: D52.2 U55.2
$1I33436\$1N478: D53.2 U56.2
$1I33452\$1N478: D54.2 U57.2
$1I33468\$1N478: D55.2 U58.2
$1I33484\$1N478: D56.2 U59.2
$1I33500\$1N478: D57.2 U60.2
$1I33516\$1N478: D58.2 U61.2
$1I33532\$1N478: D59.2 U62.2
$1I33547\$1N478: D60.2 U63.2
$1I33563\$1N478: D61.2 U64.2
$1I33579\$1N478: D62.2 U65.2
$1I33595\$1N478: D63.2 U66.2
$1I33611\$1N478: D64.2 U67.2
$1I33627\$1N478: D65.2 U68.2
$1I33643\$1N478: D66.2 U69.2
$1I33659\$1N478: D67.2 U70.2
$1I33703\$1N478: D68.2 U71.2
$1I33719\$1N478: D69.2 U72.2
$1I33735\$1N478: D70.2 U73.2
$1I33751\$1N478: D71.2 U74.2
$1I33767\$1N478: D72.2 U75.2
$1I33783\$1N478: D73.2 U76.2
$1I33799\$1N478: D74.2 U77.2
$1I33814\$1N478: D75.2 U78.2
$1I33830\$1N478: D76.2 U79.2
$1I33846\$1N478: D77.2 U80.2
$1I33862\$1N478: D78.2 U81.2
$1I33878\$1N478: D79.2 U82.2
$1I33924\$1N478: D80.2 U83.2
$1I33956\$1N478: D81.2 U84.2
$1I33986\$1N478: D82.2 U85.2
$1I34015\$1N478: D83.2 U86.2
$1I34031\$1N478: D84.2 U87.2
$1I34101\$1N478: D85.2 U88.2
$1I34144\$1N478: D128.2 U132.2
$2I2719\$1N478: D86.2 U89.2
$2I2733\$1N478: D87.2 U90.2
$2I2748\$1N478: D88.2 U91.2
$2I2763\$1N478: D89.2 U92.2
$2I2778\$1N478: D90.2 U93.2
$2I2794\$1N478: D91.2 U94.2
$2I2810\$1N478: D92.2 U95.2
$2I2825\$1N478: D93.2 U96.2
$2I2841\$1N478: D94.2 U97.2
$2I2857\$1N478: D95.2 U98.2
$2I2872\$1N478: D96.2 U99.2
$2I2888\$1N478: D97.2 U100.2
$2I2904\$1N478: D98.2 U101.2
$2I2919\$1N478: D99.2 U102.2
$2I2935\$1N478: D100.2 U103.2
$2I2951\$1N478: D101.2 U104.2
$2I2966\$1N478: D102.2 U105.2
$2I2982\$1N478: D103.2 U106.2
$2I2998\$1N478: D104.2 U107.2
$2I3013\$1N478: D105.2 U108.2
$2I3028\$1N478: D106.2 U109.2
$2I3043\$1N478: D107.2 U110.2
$2I3058\$1N478: D108.2 U111.2
$2I3074\$1N478: D109.2 U112.2
$2I3090\$1N478: D110.2 U113.2
$2I3106\$1N478: D111.2 U114.2
$2I3122\$1N478: D112.2 U115.2
$2I3138\$1N478: D113.2 U116.2
$2I3154\$1N478: D114.2 U117.2
$2I3170\$1N478: D115.2 U118.2
$2I3186\$1N478: D116.2 U119.2
$2I3202\$1N478: D117.2 U120.2
$2I3218\$1N478: D118.2 U121.2
$2I3234\$1N478: D119.2 U122.2
$2I3250\$1N478: D120.2 U123.2
$2I3266\$1N478: D121.2 U124.2
$2I3282\$1N478: D122.2 U125.2
$2I3314\$1N478: D123.2 U126.2
$2I3330\$1N478: D124.2 U127.2
$2I3375\$1N478: D125.2 U128.2
$2I3391\$1N478: D126.2 U129.2
$2I3453\$1N478: D127.2 U130.2
COL0: D1.1 D15.1 D31.1 D46.1 D59.1 D74.1 U131.26
COL1: D2.1 D16.1 D32.1 D47.1 D60.1 D75.1 D82.1 U131.25
COL2: D17.1 D33.1 D48.1 D61.1 D76.1 U131.24
COL3: D3.1 D18.1 D34.1 D49.1 D62.1 D83.1 U131.23
COL4: D4.1 D19.1 D35.1 D50.1 D63.1 D84.1 U131.22
COL5: D5.1 D20.1 D36.1 D51.1 D64.1 U131.21
COL6: D6.1 D21.1 D37.1 D52.1 D65.1 U131.20
COL7: D7.1 D22.1 D38.1 D53.1 D66.1 D81.1 U131.19
COL8: D8.1 D23.1 D39.1 D54.1 D67.1 U131.18
COL9: D9.1 D24.1 D40.1 D55.1 D68.1 U131.17
COL10: D10.1 D25.1 D41.1 D56.1 D69.1 U131.16
COL11: D26.1 D42.1 D57.1 D70.1 D77.1 U131.15
COL12: D11.1 D27.1 D43.1 D58.1 D71.1 D78.1 D128.1 U131.14
COL13: D12.1 D28.1 D44.1 D72.1 D73.1 D79.1 U131.13
COL14: D13.1 D29.1 D45.1 U131.12
COL15: D14.1 D30.1 D80.1 D85.1 U131.11
COL16: D86.1 D89.1 D92.1 D95.1 D98.1 D101.1 U131.48
COL17: D87.1 D90.1 D93.1 D96.1 D99.1 D102.1 U131.47
COL18: D88.1 D91.1 D94.1 D97.1 D100.1 D103.1 U131.46
COL19: D104.1 D108.1 D112.1 D116.1 D120.1 D123.1 D127.1 U131.45
COL20: D105.1 D109.1 D113.1 D117.1 D121.1 D124.1 U131.44
COL21: D106.1 D110.1 D114.1 D118.1 D122.1 D125.1 U131.43
COL22: D107.1 D111.1 D115.1 D119.1 D126.1 U131.42
D+: U131.34 USB1.A6 USB1.B6
D-: U131.33 USB1.A7 USB1.B7
LED0: U5.7 U131.30
LED1: U5.6 U131.31
LED2: U5.5 U131.38
LED3: U5.4 U131.39
LED4: U5.3 U131.40
LED5: U5.2 U131.41
LED6: U5.1 U131.1
ROW1: U1.1 U4.1 U6.1 U7.1 U8.1 U9.1 U10.1 U11.1 U12.1 U13.1 U14.1 U15.1 U16.1 U17.1 U89.1 U90.1 U91.1 U107.1 U108.1 U109.1 U110.1 U131.28
ROW2: U18.1 U19.1 U20.1 U21.1 U22.1 U23.1 U24.1 U25.1 U26.1 U27.1 U28.1 U29.1 U30.1 U31.1 U32.1 U33.1 U88.1 U92.1 U93.1 U94.1 U111.1 U112.1 U113.1 U114.1 U131.29
ROW3: U34.1 U35.1 U36.1 U37.1 U38.1 U39.1 U40.1 U41.1 U42.1 U43.1 U44.1 U45.1 U46.1 U47.1 U48.1 U95.1 U96.1 U97.1 U115.1 U116.1 U117.1 U118.1 U131.32
ROW4: U49.1 U50.1 U51.1 U52.1 U53.1 U54.1 U55.1 U56.1 U57.1 U58.1 U59.1 U60.1 U61.1 U76.1 U85.1 U98.1 U99.1 U100.1 U119.1 U120.1 U121.1 U122.1 U131.35
ROW5: JP1.1 U62.1 U63.1 U64.1 U65.1 U66.1 U67.1 U68.1 U69.1 U70.1 U71.1 U72.1 U73.1 U74.1 U75.1 U101.1 U102.1 U103.1 U123.1 U124.1 U125.1 U131.36 U132.1
ROW6: U77.1 U78.1 U79.1 U80.1 U81.1 U82.1 U83.1 U84.1 U86.1 U87.1 U104.1 U105.1 U106.1 U126.1 U127.1 U128.1 U129.1 U130.1 U131.37
$3N1762: R2.2 USB1.A5
$3N1766: R1.2 USB1.B5
$3N5027: R7.2 U5.16
$3N5032: R8.2 U5.15
$3N5038: R9.2 U5.14
$3N5044: R10.2 U5.13
$3N5050: R11.2 U5.12
$3N5056: R12.2 U5.11
$3N6143: H1.8 R7.1
$3N6155: H1.7 R8.1
$3N6167: H1.6 R9.1
$3N6179: H1.5 R10.1
$3N6191: H1.4 R11.1
$3N6204: H1.3 R12.1
$3N6209: R13.2 U5.10
$3N6215: H1.2 R13.1

Pads without a net: U131 2 3 8 9 27; USB1 A8 B8

## Via types
v1: diameter 0.61, hole 0.305, Top Layer to Bottom Layer, 276 vias

## Routing (per net, layer and track width the routed paths; a pad name or vN(x,y) marks a point on that pad's centre or on a via; arc(x,y) is an arc through that point)
+5V: length 92.4
  Bottom Layer w0.305: USB1.B4A9 433.74,146.29 433.74,148.46 433.14,149.06 ; 429.32,149.06 429.32,146.29 USB1.A4B9
  Bottom Layer w0.5: U3.3 419.4,143.95 423.92,143.95 423.99,144.01 423.99,146.39 426.66,149.06 429.32,149.06 ; U5.9 481.83,139.64 482.78,140.58 482.78,143.59 484.58,145.4 491.78,145.4 H1.1
  Bottom Layer w0.508: U5.9 479.11,139.64 476.5,142.24 470.66,142.24 468.63,144.27 468.63,147.32 466.89,149.06 429.32,149.06
GND: length 1359.8
  Top Layer w0.305: SCREW2.1 472.44,143.83 v1(472.44,140.21) ; v1(431.04,128.27) 429.01,130.3 v1(429.01,141.22)
  Top Layer w0.508: USB1.4 USB1.2 ; USB1.3 USB1.1
  Bottom Layer w0.203: USB1.B1A12 434.73,144.61 435.29,144.04
  Bottom Layer w0.305: v1(472.44,140.21) 473.01,139.64 U5.8 ; v1(429.01,141.22) 424.89,141.22 C3.2 ; U131.7 431.45,128.68 v1(431.04,128.27)
  Bottom Layer w0.5: USB1.2 435.85,144.6 435.29,144.04 ; 421.73,150.81 419.24,148.33
  Bottom Layer w0.508: C1.1 425.17,141.78 424.75,141.36 ; C1.1 425.17,144.63 USB1.1 ; C1.1 427.99,143.95 R2.1 428.09,145.85 USB1.A1B12 ; 424.75,141.36 C2.2 ; 424.75,141.36 C3.2 ; 247.65,150.81 SCREW5.1 254,150.81 338.14,150.81 SCREW9.1 345.06,151.38 421.15,151.38 421.73,150.81 421.74,150.82 USB1.3 USB1.4 473.07,150.82 SCREW2.1 479.43,150.81 495.3,150.81 496.89,149.23 496.89,7.94 SCREW4.1 490.54,1.59 411.16,1.59 SCREW8.1 404.81,1.59 344.49,1.59 SCREW11.1 338.14,1.59 254,1.59 SCREW10.1 247.65,1.59 134.94,1.59 SCREW12.1 128.59,1.59 7.94,1.59 SCREW3.1 1.59,7.94 1.59,144.46 SCREW1.1 7.94,150.81 128.59,150.81 SCREW13.1 134.94,150.81 247.65,150.81
  vias: v1(327.02,71.44)
VCC: length 75.5
  Top Layer w0.203: v1(442.47,143.26) 422.4,143.26 421.39,142.24 v1(415.04,142.24)
  Bottom Layer w0.203: v1(442.47,143.26) 443.48,143.26 443.99,143.76 443.99,144.78 443.49,145.28 JP1.2 ; 429.95,135.96 429.95,135.95 U131.10 ; 431.96,133.96 431.95,133.95 U131.6 ; 432.54,133.37 432.45,133.28 U131.5 ; U131.4 432.95,132.59
  Bottom Layer w0.508: 432.95,132.59 432.95,132.97 425.7,140.21 423.61,140.21 C2.1 421.64,140.27 419.42,142.49 416.05,142.49 412.66,145.89 U3.2
$1I32594\$1N478: length 5.3
  Bottom Layer w0.254: 30.54,128.91 29.58,129.86 29.58,131.77 29.4,131.95 D1.2
$1I32622\$1N478: length 5.3
  Bottom Layer w0.254: D2.2 70.68,131.95 70.86,131.77 70.86,129.86 71.81,128.91
$1I32637\$1N478: length 5.3
  Bottom Layer w0.254: 105.15,128.91 104.19,129.86 104.19,131.77 104.01,131.95 D3.2
$1I32652\$1N478: length 5.3
  Bottom Layer w0.254: D4.2 123.06,131.95 123.24,131.77 123.24,129.86 124.2,128.91
$1I32667\$1N478: length 5.3
  Bottom Layer w0.254: D5.2 142.11,131.95 142.29,131.77 142.29,129.86 143.25,128.91
$1I32682\$1N478: length 5.3
  Bottom Layer w0.254: D6.2 161.16,131.95 161.34,131.77 161.34,129.86 162.3,128.91
$1I32697\$1N478: length 5.3
  Bottom Layer w0.254: 190.88,128.91 189.92,129.86 189.92,131.77 189.74,131.95 D7.2
$1I32712\$1N478: length 5.3
  Bottom Layer w0.254: 209.93,128.91 208.97,129.86 208.97,131.77 208.79,131.95 D8.2
$1I32727\$1N478: length 5.3
  Bottom Layer w0.254: 228.97,128.91 228.02,129.86 228.02,131.77 227.84,131.95 D9.2
$1I32742\$1N478: length 5.3
  Bottom Layer w0.254: D10.2 246.89,131.95 247.07,131.77 247.07,129.86 248.03,128.91
$1I32757\$1N478: length 5.3
  Bottom Layer w0.254: 276.6,128.91 275.64,129.86 275.64,131.77 275.46,131.95 D11.2
$1I32772\$1N478: length 5.3
  Bottom Layer w0.254: D12.2 294.51,131.95 294.69,131.77 294.69,129.86 295.65,128.91
$1I32787\$1N478: length 5.3
  Bottom Layer w0.254: D13.2 313.56,131.95 313.74,131.77 313.74,129.86 314.7,128.91
$1I32802\$1N478: length 5.3
  Bottom Layer w0.254: 333.75,128.91 332.79,129.86 332.79,131.77 332.61,131.95 D14.2
$1I32817\$1N478: length 5.3
  Bottom Layer w0.254: D15.2 29.4,103.38 29.58,103.2 29.58,101.29 30.54,100.33
$1I32832\$1N478: length 5.3
  Bottom Layer w0.254: 67.05,100.33 66.09,101.29 66.09,103.2 65.91,103.38 D16.2
$1I32848\$1N478: length 5.3
  Bottom Layer w0.254: D17.2 84.96,103.38 85.14,103.2 85.14,101.29 86.1,100.33
$1I32863\$1N478: length 5.3
  Bottom Layer w0.254: 105.15,100.33 104.19,101.29 104.19,103.2 104.01,103.38 D18.2
$1I32879\$1N478: length 5.3
  Bottom Layer w0.254: 124.2,100.33 123.24,101.29 123.24,103.2 123.06,103.38 D19.2
$1I32895\$1N478: length 5.3
  Bottom Layer w0.254: 143.25,100.33 142.29,101.29 142.29,103.2 142.11,103.38 D20.2
$1I32911\$1N478: length 5.3
  Bottom Layer w0.254: 162.3,100.33 161.34,101.29 161.34,103.2 161.16,103.38 D21.2
$1I32927\$1N478: length 5.3
  Bottom Layer w0.254: 181.35,100.33 180.39,101.29 180.39,103.2 180.21,103.38 D22.2
$1I32943\$1N478: length 5.3
  Bottom Layer w0.254: D23.2 199.26,103.38 199.44,103.2 199.44,101.29 200.4,100.33
$1I32959\$1N478: length 5.3
  Bottom Layer w0.254: 219.45,100.33 218.49,101.29 218.49,103.2 218.31,103.38 D24.2
$1I32975\$1N478: length 5.3
  Bottom Layer w0.254: 238.5,100.33 237.54,101.29 237.54,103.2 237.36,103.38 D25.2
$1I32991\$1N478: length 5.3
  Bottom Layer w0.254: 257.55,100.33 256.59,101.29 256.59,103.2 256.41,103.38 D26.2
$1I33006\$1N478: length 5.3
  Bottom Layer w0.254: 276.6,100.33 275.64,101.29 275.64,103.2 275.46,103.38 D27.2
$1I33022\$1N478: length 5.3
  Bottom Layer w0.254: D28.2 294.51,103.38 294.69,103.2 294.69,101.29 295.65,100.33
$1I33038\$1N478: length 5.3
  Bottom Layer w0.254: 314.7,100.33 313.74,101.29 313.74,103.2 313.56,103.38 D29.2
$1I33054\$1N478: length 2.3
  Bottom Layer w0.254: D30.2 333.12,100.34 333.12,100.33
$1I33070\$1N478: length 5.3
  Bottom Layer w0.254: 30.54,81.28 29.58,82.24 29.58,84.15 29.4,84.33 D31.2
$1I33085\$1N478: length 5.3
  Bottom Layer w0.254: D32.2 70.68,84.33 70.86,84.15 70.86,82.24 71.81,81.28
$1I33101\$1N478: length 5.3
  Bottom Layer w0.254: D33.2 94.49,84.33 94.67,84.15 94.67,82.24 95.62,81.28
$1I33117\$1N478: length 5.3
  Bottom Layer w0.254: 114.67,81.28 113.72,82.24 113.72,84.15 113.54,84.33 D34.2
$1I33133\$1N478: length 5.3
  Bottom Layer w0.254: D35.2 132.59,84.33 132.77,84.15 132.77,82.24 133.72,81.28
$1I33149\$1N478: length 5.3
  Bottom Layer w0.254: D36.2 151.64,84.33 151.82,84.15 151.82,82.24 152.78,81.28
$1I33165\$1N478: length 5.3
  Bottom Layer w0.254: 171.82,81.28 170.87,82.24 170.87,84.15 170.69,84.33 D37.2
$1I33181\$1N478: length 5.3
  Bottom Layer w0.254: 190.88,81.28 189.92,82.24 189.92,84.15 189.74,84.33 D38.2
$1I33197\$1N478: length 5.3
  Bottom Layer w0.254: D39.2 208.79,84.33 208.97,84.15 208.97,82.24 209.93,81.28
$1I33213\$1N478: length 5.3
  Bottom Layer w0.254: D40.2 227.84,84.33 228.02,84.15 228.02,82.24 228.97,81.28
$1I33229\$1N478: length 5.3
  Bottom Layer w0.254: 248.03,81.28 247.07,82.24 247.07,84.15 246.89,84.33 D41.2
$1I33245\$1N478: length 5.3
  Bottom Layer w0.254: 264.2,84.33 265.94,84.33 266.12,84.15 266.12,82.24 267.07,81.28
$1I33261\$1N478: length 5.3
  Bottom Layer w0.254: D43.2 284.99,84.33 285.17,84.15 285.17,82.24 286.12,81.28
$1I33277\$1N478: length 5.3
  Bottom Layer w0.254: D44.2 304.04,84.33 304.22,84.15 304.22,82.24 305.18,81.28
$1I33293\$1N478: length 5.3
  Bottom Layer w0.254: 328.99,81.28 328.03,82.24 328.03,84.15 327.85,84.33 D45.2
$1I33325\$1N478: length 5.3
  Bottom Layer w0.254: D46.2 29.4,65.28 29.58,65.1 29.58,63.19 30.54,62.23
$1I33340\$1N478: length 5.3
  Bottom Layer w0.254: D47.2 66.8,65.13 66.98,64.95 66.98,63.04 67.94,62.08
$1I33356\$1N478: length 5.3
  Bottom Layer w0.254: 100.39,62.23 99.43,63.19 99.43,65.1 99.25,65.28 D48.2
$1I33372\$1N478: length 5.3
  Bottom Layer w0.254: 119.44,62.23 118.48,63.19 118.48,65.1 118.3,65.28 D49.2
$1I33388\$1N478: length 5.3
  Bottom Layer w0.254: 138.49,62.23 137.53,63.19 137.53,65.1 137.35,65.28 D50.2
$1I33404\$1N478: length 5.3
  Bottom Layer w0.254: 157.54,62.23 156.58,63.19 156.58,65.1 156.4,65.28 D51.2
$1I33420\$1N478: length 5.3
  Bottom Layer w0.254: 176.59,62.23 175.63,63.19 175.63,65.1 175.45,65.28 D52.2
$1I33436\$1N478: length 5.3
  Bottom Layer w0.254: 195.64,62.23 194.68,63.19 194.68,65.1 194.5,65.28 D53.2
$1I33452\$1N478: length 5.3
  Bottom Layer w0.254: D54.2 213.55,65.28 213.73,65.1 213.73,63.19 214.69,62.23
$1I33468\$1N478: length 5.3
  Bottom Layer w0.254: 233.74,62.23 232.78,63.19 232.78,65.1 232.6,65.28 D55.2
$1I33484\$1N478: length 5.3
  Bottom Layer w0.254: D56.2 251.65,65.28 251.83,65.1 251.83,63.19 252.79,62.23
$1I33500\$1N478: length 5.3
  Bottom Layer w0.254: 271.84,62.23 270.88,63.19 270.88,65.1 270.7,65.28 D57.2
$1I33516\$1N478: length 5.3
  Bottom Layer w0.254: 290.89,62.23 289.93,63.19 289.93,65.1 289.75,65.28 D58.2
$1I33532\$1N478: length 5.3
  Bottom Layer w0.254: 30.54,43.18 29.58,44.14 29.58,46.05 29.4,46.23 D59.2
$1I33547\$1N478: length 5.3
  Bottom Layer w0.254: 78.96,43.18 78,44.14 78,46.05 77.82,46.23 D60.2
$1I33563\$1N478: length 5.3
  Bottom Layer w0.254: 109.91,43.18 108.95,44.14 108.95,46.05 108.78,46.23 D61.2
$1I33579\$1N478: length 5.3
  Bottom Layer w0.254: D62.2 127.83,46.23 128,46.05 128,44.14 128.96,43.18
$1I33595\$1N478: length 5.3
  Bottom Layer w0.254: D63.2 146.88,46.23 147.06,46.05 147.06,44.14 148.01,43.18
$1I33611\$1N478: length 5.3
  Bottom Layer w0.254: D64.2 165.93,46.23 166.11,46.05 166.11,44.14 167.06,43.18
$1I33627\$1N478: length 5.3
  Bottom Layer w0.254: 186.11,43.18 185.16,44.14 185.16,46.05 184.98,46.23 D65.2
$1I33643\$1N478: length 5.3
  Bottom Layer w0.254: 205.16,43.18 204.2,44.14 204.2,46.05 204.03,46.23 D66.2
$1I33659\$1N478: length 5.3
  Bottom Layer w0.254: D67.2 223.08,46.23 223.25,46.05 223.25,44.14 224.21,43.18
$1I33703\$1N478: length 5.3
  Bottom Layer w0.254: D68.2 242.13,46.23 242.31,46.05 242.31,44.14 243.26,43.18
$1I33719\$1N478: length 5.3
  Bottom Layer w0.254: 262.31,43.18 261.36,44.14 261.36,46.05 261.18,46.23 D69.2
$1I33735\$1N478: length 5.3
  Bottom Layer w0.254: D70.2 280.23,46.23 280.4,46.05 280.4,44.14 281.36,43.18
$1I33751\$1N478: length 5.3
  Bottom Layer w0.254: 303.63,33.02 304.59,32.06 304.59,30.15 304.77,29.97 D71.2
$1I33767\$1N478: length 5.3
  Bottom Layer w0.254: 333.75,43.18 332.79,44.14 332.79,46.05 332.61,46.23 D72.2
$1I33783\$1N478: length 5.3
  Bottom Layer w0.254: 321.84,62.23 320.88,63.19 320.88,65.1 320.71,65.28 D73.2
$1I33799\$1N478: length 5.3
  Bottom Layer w0.254: 30.54,24.13 29.58,25.09 29.58,27 29.4,27.18 D74.2
$1I33814\$1N478: length 5.3
  Bottom Layer w0.254: D75.2 67.5,27.18 67.68,27 67.68,25.09 68.64,24.13
$1I33830\$1N478: length 5.3
  Bottom Layer w0.254: 90.86,24.13 89.91,25.09 89.91,27 89.73,27.18 D76.2
$1I33846\$1N478: length 5.3
  Bottom Layer w0.254: 264.2,27.18 265.94,27.18 266.12,27 266.12,25.09 267.07,24.13
$1I33862\$1N478: length 5.3
  Bottom Layer w0.254: 286.12,24.13 285.17,25.09 285.17,27 284.99,27.18 D78.2
$1I33878\$1N478: length 5.3
  Bottom Layer w0.254: D79.2 307.21,27.18 307.39,27 307.39,25.09 308.35,24.13
$1I33924\$1N478: length 5.3
  Bottom Layer w0.254: D80.2 330.23,27.18 330.41,27 330.41,25.09 331.37,24.13
$1I33956\$1N478: length 5.3
  Bottom Layer w0.254: D81.2 185.71,10.92 185.53,11.1 185.53,13.01 184.57,13.97
$1I33986\$1N478: length 5.3
  Bottom Layer w0.254: D82.2 61.88,49.02 61.7,49.2 61.7,51.11 60.74,52.07
$1I34015\$1N478: length 5.3
  Bottom Layer w0.254: 109.91,24.13 108.95,25.09 108.95,27 108.78,27.18 D83.2
$1I34031\$1N478: length 5.3
  Bottom Layer w0.254: D84.2 129.41,27.18 129.59,27 129.59,25.09 130.55,24.13
$1I34101\$1N478: length 5.3
  Bottom Layer w0.254: 310.77,90.17 311.73,89.21 311.73,87.3 311.91,87.12 D85.2
$1I34144\$1N478: length 3.1
  Bottom Layer w0.203: D128.2 306.93,44.85 U132.2
$2I2719\$1N478: length 5.3
  Bottom Layer w0.254: D86.2 361.19,131.95 361.37,131.77 361.37,129.86 362.32,128.91
$2I2733\$1N478: length 5.3
  Bottom Layer w0.254: D87.2 380.24,131.95 380.42,131.77 380.42,129.86 381.38,128.91
$2I2748\$1N478: length 5.3
  Bottom Layer w0.254: D88.2 399.29,131.95 399.47,131.77 399.47,129.86 400.43,128.91
$2I2763\$1N478: length 5.3
  Bottom Layer w0.254: 362.32,100.33 361.37,101.29 361.37,103.2 361.19,103.38 D89.2
$2I2778\$1N478: length 5.3
  Bottom Layer w0.254: D90.2 380.24,103.38 380.42,103.2 380.42,101.29 381.38,100.33
$2I2794\$1N478: length 5.3
  Bottom Layer w0.254: D91.2 399.29,103.38 399.47,103.2 399.47,101.29 400.43,100.33
$2I2810\$1N478: length 5.3
  Bottom Layer w0.254: D92.2 361.19,84.33 361.37,84.15 361.37,82.24 362.32,81.28
$2I2825\$1N478: length 5.3
  Bottom Layer w0.254: D93.2 380.24,84.33 380.42,84.15 380.42,82.24 381.38,81.28
$2I2841\$1N478: length 5.3
  Bottom Layer w0.254: 400.43,81.28 399.47,82.24 399.47,84.15 399.29,84.33 D94.2
$2I2857\$1N478: length 5.3
  Bottom Layer w0.254: 362.32,62.23 361.37,63.19 361.37,65.1 361.19,65.28 D95.2
$2I2872\$1N478: length 5.3
  Bottom Layer w0.254: D96.2 380.24,65.28 380.42,65.1 380.42,63.19 381.38,62.23
$2I2888\$1N478: length 5.3
  Bottom Layer w0.254: D97.2 399.29,65.28 399.47,65.1 399.47,63.19 400.43,62.23
$2I2904\$1N478: length 5.3
  Bottom Layer w0.254: 362.32,43.18 361.37,44.14 361.37,46.05 361.19,46.23 D98.2
$2I2919\$1N478: length 5.3
  Bottom Layer w0.254: D99.2 380.24,46.23 380.42,46.05 380.42,44.14 381.38,43.18
$2I2935\$1N478: length 5.3
  Bottom Layer w0.254: 400.43,43.18 399.47,44.14 399.47,46.05 399.29,46.23 D100.2
$2I2951\$1N478: length 5.3
  Bottom Layer w0.254: 362.32,24.13 361.37,25.09 361.37,27 361.19,27.18 D101.2
$2I2966\$1N478: length 5.3
  Bottom Layer w0.254: D102.2 380.24,27.18 380.42,27 380.42,25.09 381.38,24.13
$2I2982\$1N478: length 5.3
  Bottom Layer w0.254: D103.2 399.29,27.18 399.47,27 399.47,25.09 400.43,24.13
$2I2998\$1N478: length 5.3
  Bottom Layer w0.254: 429,119.38 428.04,120.34 428.04,122.25 427.86,122.43 D104.2
$2I3013\$1N478: length 5.3
  Bottom Layer w0.254: 448.05,119.38 447.09,120.34 447.09,122.25 446.91,122.43 D105.2
$2I3028\$1N478: length 5.3
  Bottom Layer w0.254: D106.2 465.96,122.43 466.14,122.25 466.14,120.34 467.1,119.38
$2I3043\$1N478: length 5.3
  Bottom Layer w0.254: D107.2 485.01,122.43 485.19,122.25 485.19,120.34 486.15,119.38
$2I3058\$1N478: length 5.3
  Bottom Layer w0.254: 429,100.33 428.04,101.29 428.04,103.2 427.86,103.38 D108.2
$2I3074\$1N478: length 5.3
  Bottom Layer w0.254: D109.2 446.91,103.38 447.09,103.2 447.09,101.29 448.05,100.33
$2I3090\$1N478: length 5.3
  Bottom Layer w0.254: D110.2 465.96,103.38 466.14,103.2 466.14,101.29 467.1,100.33
$2I3106\$1N478: length 5.3
  Bottom Layer w0.254: 486.15,100.33 485.19,101.29 485.19,103.2 485.01,103.38 D111.2
$2I3122\$1N478: length 5.3
  Bottom Layer w0.254: D112.2 427.92,84.33 428.1,84.15 428.1,82.24 429.06,81.28
$2I3138\$1N478: length 5.3
  Bottom Layer w0.254: D113.2 446.91,84.33 447.09,84.15 447.09,82.24 448.05,81.28
$2I3154\$1N478: length 5.3
  Bottom Layer w0.254: D114.2 465.96,84.33 466.14,84.15 466.14,82.24 467.1,81.28
$2I3170\$1N478: length 5.3
  Bottom Layer w0.254: 486.15,81.28 485.19,82.24 485.19,84.15 485.01,84.33 D115.2
$2I3186\$1N478: length 5.3
  Bottom Layer w0.254: 429,62.23 428.04,63.19 428.04,65.1 427.86,65.28 D116.2
$2I3202\$1N478: length 5.3
  Bottom Layer w0.254: 448.05,62.23 447.09,63.19 447.09,65.1 446.91,65.28 D117.2
$2I3218\$1N478: length 5.3
  Bottom Layer w0.254: D118.2 465.96,65.28 466.14,65.1 466.14,63.19 467.1,62.23
$2I3234\$1N478: length 5.3
  Bottom Layer w0.254: 486.15,62.23 485.19,63.19 485.19,65.1 485.01,65.28 D119.2
$2I3250\$1N478: length 5.3
  Bottom Layer w0.254: D120.2 427.86,46.23 428.04,46.05 428.04,44.14 429,43.18
$2I3266\$1N478: length 5.3
  Bottom Layer w0.254: 448.05,43.18 447.09,44.14 447.09,46.05 446.91,46.23 D121.2
$2I3282\$1N478: length 5.3
  Bottom Layer w0.254: 467.1,43.18 466.14,44.14 466.14,46.05 465.96,46.23 D122.2
$2I3314\$1N478: length 5.3
  Bottom Layer w0.254: D123.2 427.86,27.18 428.04,27 428.04,25.09 429,24.13
$2I3330\$1N478: length 3.4
  Bottom Layer w0.254: U127.2 447.6,24.31 D124.2
$2I3375\$1N478: length 5.3
  Bottom Layer w0.254: 467.1,24.13 466.14,25.09 466.14,27 465.96,27.18 D125.2
$2I3391\$1N478: length 5.3
  Bottom Layer w0.254: D126.2 471.3,34.16 471.48,34.34 473.39,34.34 474.35,35.3
$2I3453\$1N478: length 5.3
  Bottom Layer w0.254: D127.2 426.21,10.92 426.03,11.1 426.03,13.01 425.07,13.97
COL0: length 515.5
  Top Layer w0.203: v1(423.93,138.43) 425.96,138.43 v1(427.48,139.95)
  Bottom Layer w0.203: U131.26 429.45,139.77 429.26,139.95 v1(427.48,139.95) ; v1(32.45,132.46) 38.32,138.34 423.83,138.34 v1(423.93,138.43)
  Bottom Layer w0.254: v1(32.45,65.79) 31.94,65.28 D46.1 ; v1(32.45,65.79) v1(32.45,84.84) ; v1(32.45,65.79) v1(32.45,46.74) ; v1(32.45,103.89) v1(32.45,84.84) ; v1(32.45,103.89) 31.94,103.38 D15.1 ; v1(32.45,103.89) v1(32.45,132.46) 31.94,131.95 D1.1 ; v1(32.45,84.84) 31.94,84.33 D31.1 ; D59.1 31.94,46.23 v1(32.45,46.74) ; v1(32.45,46.74) v1(32.45,27.69) 31.94,27.18 D74.1
COL1: length 522.9
  Top Layer w0.203: v1(427.99,139.19) 426.47,137.67 v1(425.45,137.67)
  Bottom Layer w0.203: v1(427.99,139.19) 428.24,139.45 428.75,139.45 428.95,139.25 U131.25 ; v1(73.72,132.46) 79.29,138.03 419.25,138.03 419.61,137.67 v1(425.45,137.67)
  Bottom Layer w0.254: v1(58.83,48.51) 58.83,48.1 59.44,47.5 80.11,47.5 v1(80.87,46.74) ; v1(58.83,48.51) 58.83,52.99 59.94,54.1 62.48,54.1 64.4,56.01 64.4,58.55 65.53,59.69 68.07,59.69 69.85,61.47 v1(69.85,65.63) ; v1(58.83,48.51) 59.34,49.02 D82.1 ; v1(73.72,84.84) 73.22,84.33 D32.1 ; v1(73.72,84.84) 73.72,67.88 73.15,67.31 69.6,67.31 69.85,67.05 v1(69.85,65.63) ; v1(73.72,84.84) 73.72,86.04 73.15,86.61 70.1,86.61 68.96,87.76 v1(68.96,103.89) ; v1(80.87,46.74) 80.87,33.88 77.72,30.73 71.12,30.73 70.61,30.23 70.61,27.75 v1(70.55,27.69) 70.04,27.18 D75.1 ; v1(80.87,46.74) 80.36,46.23 D60.1 ; v1(69.85,65.63) 69.34,65.13 D47.1 ; v1(68.96,103.89) 68.96,115.44 69.6,116.08 72.14,116.08 73.72,117.67 v1(73.72,132.46) 73.22,131.95 D2.1 ; v1(68.96,103.89) 68.45,103.38 D16.1
COL2: length 481.8
  Bottom Layer w0.203: U131.24 419.9,136.86 419.04,137.73 92.26,137.73 88.01,133.48 v1(88.01,103.89)
  Bottom Layer w0.254: v1(111.82,46.74) 111.32,46.23 D61.1 ; v1(111.82,46.74) 111.82,31.31 110.24,29.72 94.81,29.72 v1(92.77,27.69) 92.27,27.18 D76.1 ; v1(111.82,46.74) 102.3,56.26 v1(102.3,65.79) ; D33.1 97.03,84.33 v1(97.54,84.84) ; D17.1 87.5,103.38 v1(88.01,103.89) 88.01,94.36 v1(97.54,84.84) ; v1(97.54,84.84) 97.54,70.55 v1(102.3,65.79) ; v1(102.3,65.79) 101.79,65.28 D48.1
COL3: length 463.1
  Bottom Layer w0.203: v1(107.06,132.46) 112.02,137.42 418.84,137.42 419.9,136.36 U131.23
  Bottom Layer w0.254: D34.1 116.08,84.33 v1(116.59,84.84) ; D18.1 106.55,103.38 v1(107.06,103.89) ; v1(121.35,65.79) 121.35,56.26 v1(130.87,46.74) ; v1(121.35,65.79) 116.59,70.55 v1(116.59,84.84) ; v1(121.35,65.79) 120.84,65.28 D49.1 ; D62.1 130.37,46.23 v1(130.87,46.74) ; v1(130.87,46.74) 130.87,32.07 129.03,30.23 114.36,30.23 v1(111.82,27.69) 111.32,27.18 D83.1 ; D3.1 106.55,131.95 v1(107.06,132.46) v1(107.06,103.89) ; v1(116.59,84.84) 107.06,94.36 v1(107.06,103.89)
COL4: length 442.2
  Bottom Layer w0.203: U131.22 419.89,135.86 418.64,137.12 130.76,137.12 v1(126.11,132.46)
  Bottom Layer w0.254: D84.1 131.95,27.18 v1(132.46,27.69) 135.83,31.05 148.53,31.05 149.92,32.45 v1(149.92,46.74) ; v1(149.92,46.74) 140.4,56.26 v1(140.4,65.79) ; v1(149.92,46.74) 149.42,46.23 D63.1 ; v1(135.64,84.84) 126.11,94.36 v1(126.11,103.89) ; v1(135.64,84.84) 135.64,70.55 v1(140.4,65.79) ; v1(135.64,84.84) 135.13,84.33 D35.1 ; v1(126.11,103.89) 125.6,103.38 D19.1 ; v1(126.11,103.89) v1(126.11,132.46) 125.6,131.95 D4.1 ; v1(140.4,65.79) 139.89,65.28 D50.1
COL5: length 387.9
  Bottom Layer w0.203: v1(145.16,132.46) 149.51,136.81 418.43,136.81 419.88,135.36 U131.21
  Bottom Layer w0.254: D51.1 158.94,65.28 v1(159.45,65.79) ; v1(145.16,103.89) v1(145.16,132.46) 144.65,131.95 D5.1 ; v1(145.16,103.89) 144.65,103.38 D20.1 ; v1(145.16,103.89) 145.16,94.36 v1(154.69,84.84) ; v1(159.45,65.79) 154.69,70.55 v1(154.69,84.84) ; v1(159.45,65.79) 159.45,56.26 v1(168.97,46.74) 168.47,46.23 D64.1 ; v1(154.69,84.84) 154.18,84.33 D36.1
COL6: length 368.8
  Bottom Layer w0.203: U131.20 419.87,134.86 418.23,136.5 168.25,136.5 v1(164.21,132.46)
  Bottom Layer w0.254: D6.1 163.7,131.95 v1(164.21,132.46) v1(164.21,103.89) ; D52.1 177.99,65.28 v1(178.5,65.79) ; v1(164.21,103.89) 163.7,103.38 D21.1 ; v1(164.21,103.89) 164.21,94.36 v1(173.74,84.84) ; v1(173.74,84.84) 173.23,84.33 D37.1 ; v1(173.74,84.84) 173.74,70.55 v1(178.5,65.79) ; v1(178.5,65.79) 178.5,56.26 v1(188.02,46.74) 187.52,46.23 D65.1
COL7: length 404.6
  Bottom Layer w0.203: U131.19 419.86,134.36 418.03,136.2 196.52,136.2 v1(192.79,132.46)
  Bottom Layer w0.254: D53.1 197.04,65.28 v1(197.55,65.79) ; D7.1 192.28,131.95 v1(192.79,132.46) 192.79,113.41 v1(183.26,103.89) ; v1(197.55,65.79) 197.55,56.26 v1(207.07,46.74) ; v1(197.55,65.79) 192.79,70.55 v1(192.79,84.84) ; v1(192.79,84.84) 183.26,94.36 v1(183.26,103.89) ; v1(192.79,84.84) 192.28,84.33 D38.1 ; v1(207.07,46.74) 207.07,31.05 205.74,29.72 184.4,29.72 182.66,27.98 v1(182.66,10.41) 183.17,10.92 D81.1 ; v1(207.07,46.74) 206.57,46.23 D66.1 ; v1(183.26,103.89) 182.75,103.38 D22.1
COL8: length 325
  Bottom Layer w0.203: U131.18 419.86,133.86 417.83,135.89 215.27,135.89 v1(211.84,132.46)
  Bottom Layer w0.254: D39.1 211.33,84.33 v1(211.84,84.84) ; v1(202.31,103.89) 202.31,94.36 v1(211.84,84.84) ; v1(202.31,103.89) 201.8,103.38 D23.1 ; v1(202.31,103.89) 211.84,113.41 v1(211.84,132.46) 211.33,131.95 D8.1 ; v1(211.84,84.84) 211.84,70.55 v1(216.6,65.79) ; v1(216.6,65.79) 216.09,65.28 D54.1 ; v1(216.6,65.79) 216.6,56.26 v1(226.12,46.74) 225.62,46.23 D67.1
COL9: length 305.9
  Bottom Layer w0.203: U131.17 419.85,133.36 417.62,135.59 234.01,135.59 v1(230.89,132.46)
  Bottom Layer w0.254: D68.1 244.67,46.23 v1(245.17,46.74) 235.65,56.26 v1(235.65,65.79) ; v1(230.89,84.84) 230.38,84.33 D40.1 ; v1(230.89,84.84) 221.36,94.36 v1(221.36,103.89) ; v1(230.89,84.84) 230.89,70.55 v1(235.65,65.79) ; D55.1 235.14,65.28 v1(235.65,65.79) ; D24.1 220.85,103.38 v1(221.36,103.89) ; v1(221.36,103.89) 230.89,113.41 v1(230.89,132.46) 230.38,131.95 D9.1
COL10: length 286.8
  Bottom Layer w0.203: U131.16 419.84,132.86 417.42,135.28 252.76,135.28 v1(249.94,132.46)
  Bottom Layer w0.254: v1(249.94,84.84) 249.94,70.55 v1(254.7,65.79) ; v1(249.94,84.84) 240.41,94.36 v1(240.41,103.89) ; v1(249.94,84.84) 249.43,84.33 D41.1 ; v1(254.7,65.79) 254.19,65.28 D56.1 ; v1(254.7,65.79) 254.7,56.26 v1(264.22,46.74) 263.72,46.23 D69.1 ; v1(240.41,103.89) 249.94,113.41 v1(249.94,132.46) 249.43,131.95 D10.1 ; v1(240.41,103.89) 239.9,103.38 D25.1
COL11: length 305.5
  Bottom Layer w0.203: v1(259.46,103.89) 258.06,105.28 258.06,130.56 262.49,134.98 417.22,134.98 419.83,132.36 U131.15
  Bottom Layer w0.254: v1(273.75,65.79) 268.99,70.55 v1(268.99,84.84) ; v1(273.75,65.79) 273.75,56.26 v1(283.27,46.74) ; v1(273.75,65.79) 273.24,65.28 D57.1 ; D26.1 258.95,103.38 v1(259.46,103.89) 259.46,94.36 v1(268.99,84.84) ; v1(268.99,84.84) 268.48,84.33 D42.1 ; v1(283.27,46.74) 282.77,46.23 D70.1 ; v1(283.27,46.74) 283.27,31.05 281.94,29.72 271.02,29.72 v1(268.99,27.69) 268.48,27.18 D77.1
COL12: length 304.1
  Bottom Layer w0.203: 307.98,50.29 307.98,50.29 D128.1 ; v1(288.04,27.69) 288.73,28.38 300.63,28.38 v1(301.72,29.46) ; U131.14 419.82,131.86 417.01,134.67 280.72,134.67 v1(278.51,132.46)
  Bottom Layer w0.254: v1(288.04,84.84) 288.04,70.55 v1(292.8,65.79) ; v1(288.04,84.84) 287.53,84.33 D43.1 ; v1(288.04,84.84) 278.51,94.36 v1(278.51,103.89) ; v1(292.8,65.79) 292.29,65.28 D58.1 ; v1(292.8,65.79) 292.8,53.85 293.05,53.59 304.68,53.59 307.98,50.29 308.81,50.29 309.48,49.63 309.48,41.31 308.47,40.3 304.49,40.3 303.7,39.51 303.7,36.33 301.75,34.38 301.75,29.5 302.23,29.97 D71.1 ; D27.1 278,103.38 v1(278.51,103.89) ; v1(288.04,27.69) 287.53,27.18 D78.1 ; v1(278.51,103.89) v1(278.51,132.46) 278,131.95 D11.1
COL13: length 293.5
  Bottom Layer w0.203: U131.13 419.82,131.36 416.81,134.37 299.47,134.37 v1(297.56,132.46)
  Bottom Layer w0.254: D28.1 297.05,103.38 ; 297.05,103.38 v1(297.56,103.89) v1(297.56,132.46) 297.05,131.95 D12.1 ; 297.05,103.38 296.77,103.09 296.77,92.77 303.92,85.62 306.3,85.62 v1(307.09,84.84) ; v1(335.66,46.74) 335.66,31.72 332.32,28.38 310.95,28.38 v1(310.26,27.69) 309.75,27.18 D79.1 ; v1(335.66,46.74) 323.75,58.64 v1(323.75,65.79) ; v1(335.66,46.74) 335.15,46.23 D72.1 ; 305.77,84.33 306.58,84.33 v1(307.09,84.84) ; v1(307.09,84.84) 307.09,69.6 308.36,68.33 321.21,68.33 v1(323.75,65.79) ; v1(323.75,65.79) 323.25,65.28 D73.1
